# Altium schematic sheet FPGA_POWER.SchDoc
size A3
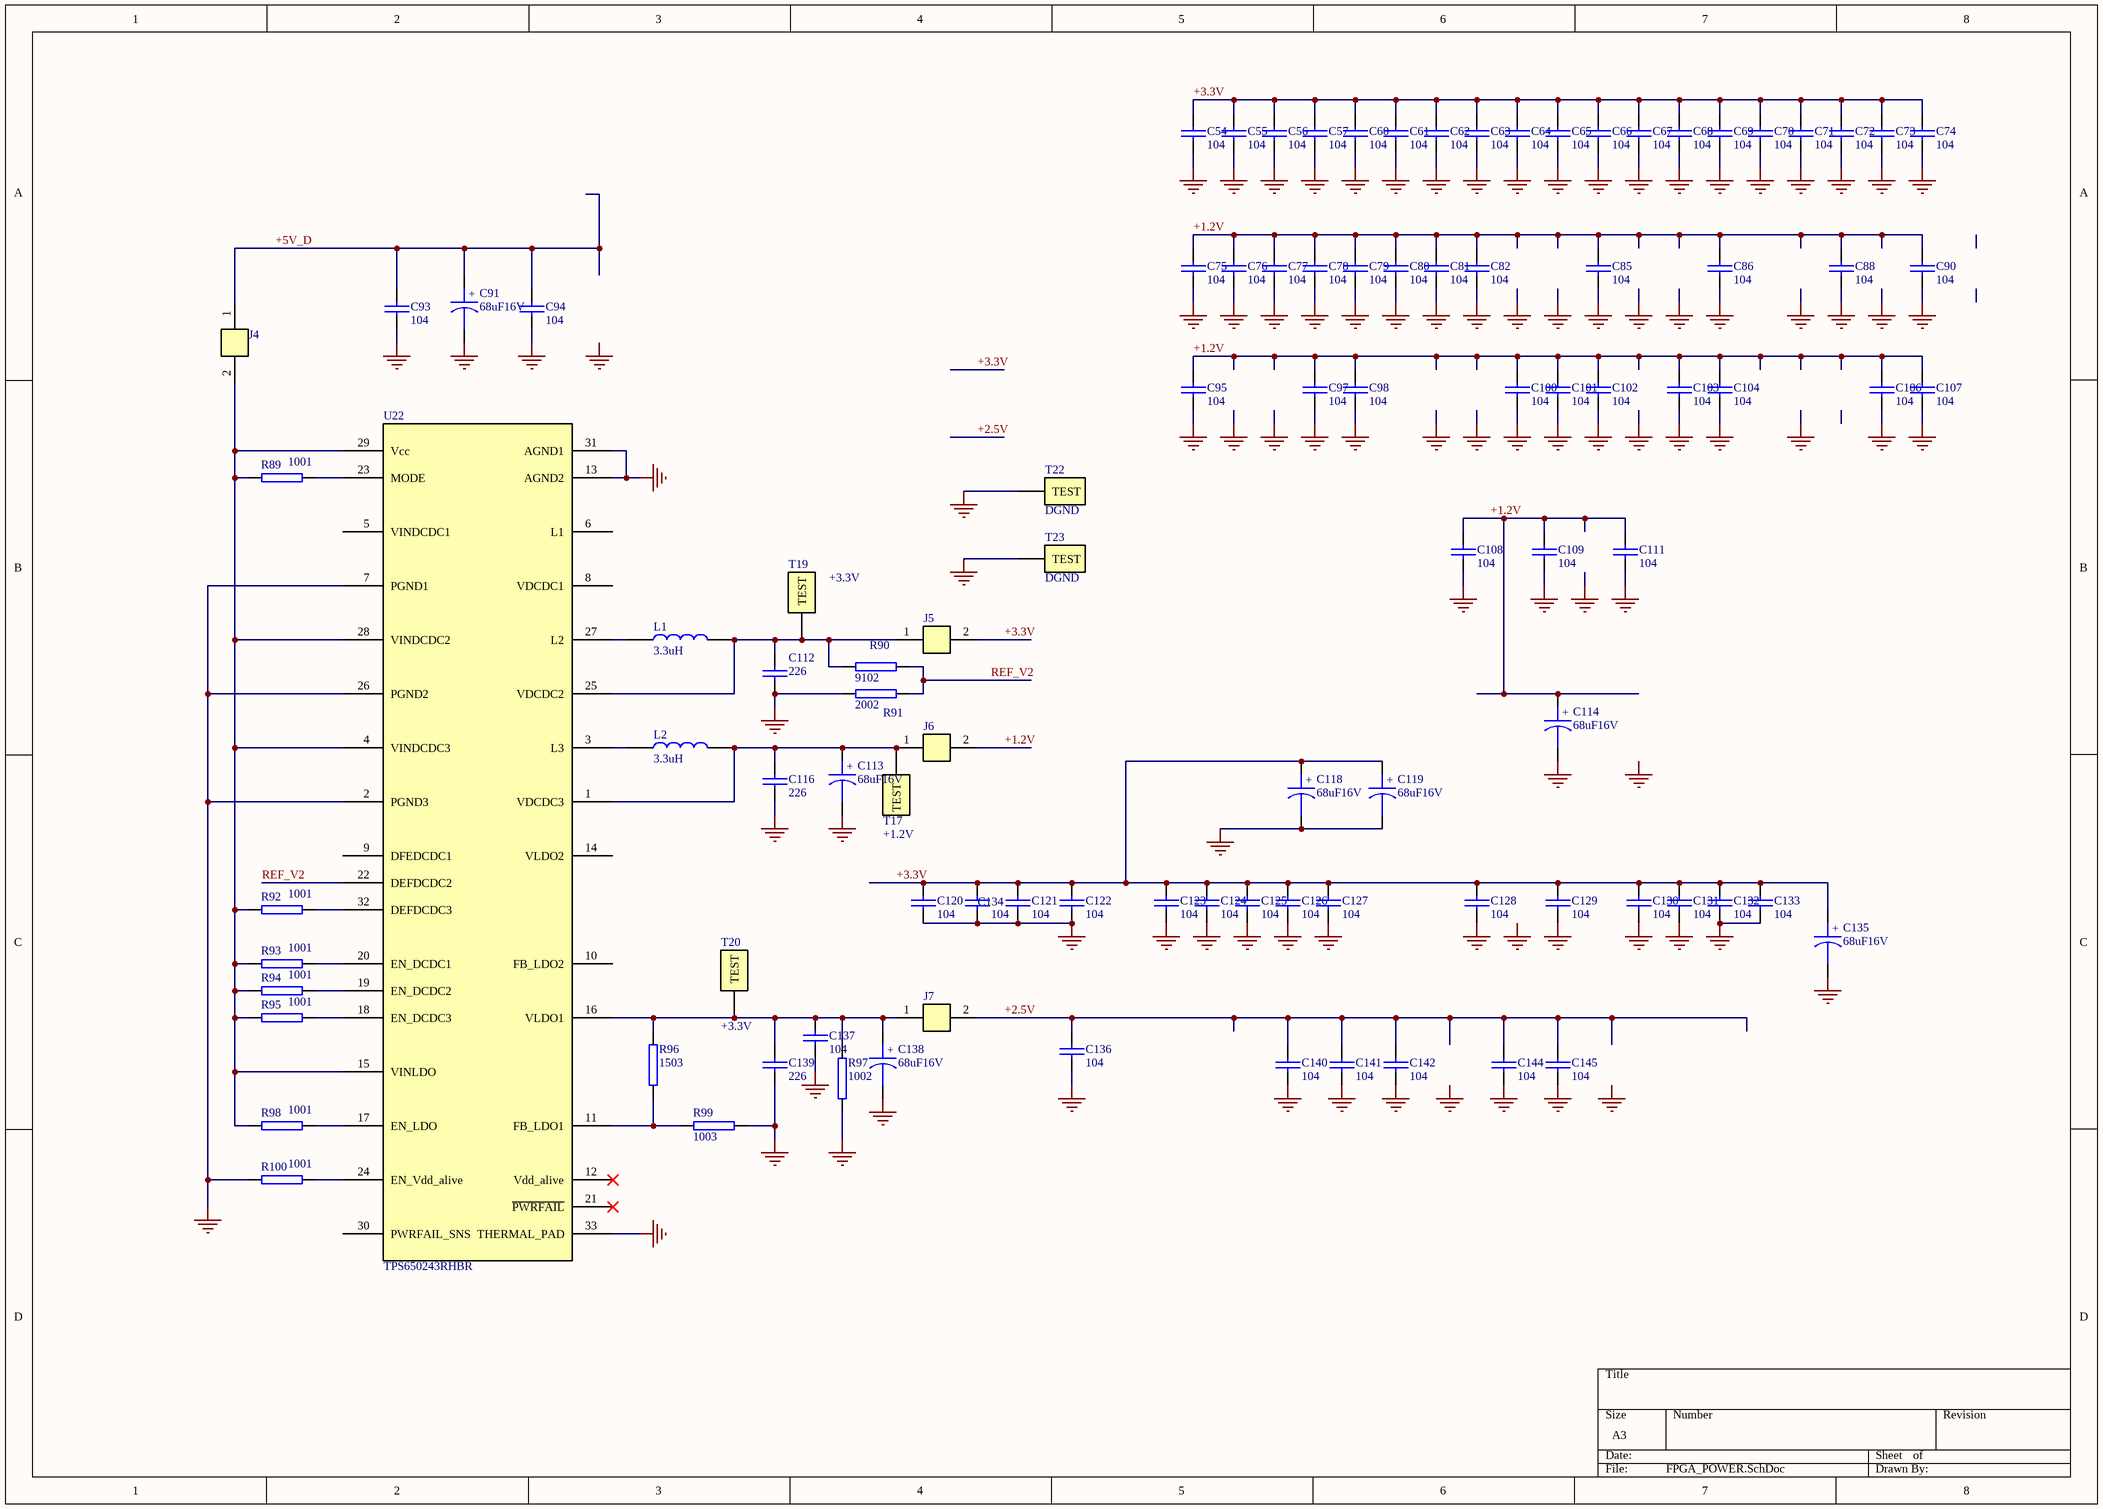
[diagram p0: FPGA_POWER.SchDoc]

## Parts
C54  104  [0805C]
C55  104  [0402C]
C56  104  [0402C]
C57  104  [0402C]
C60  104  [0402C]
C61  104  [0402C]
C62  104  [0402C]
C63  104  [0402C]
C64  104  [0402C]
C65  104  [0402C]
C66  104  [0402C]
C67  104  [0402C]
C68  104  [0402C]
C69  104  [0402C]
C70  104  [0402C]
C71  104  [0402C]
C72  104  [0402C]
C73  104  [0402C]
C74  104  [0402C]
C75  104  [0805C]
C76  104  [0402C]
C77  104  [0402C]
C78  104  [0805C]
C79  104  [0402C]
C80  104  [0402C]
C81  104  [0402C]
C82  104  [0402C]
C85  104  [0402C]
C86  104  [0402C]
C88  104  [0402C]
C90  104  [0402C]
C91  68uF16V  [6032]
C93  104  [0805C]
C94  104  [0805C]
C95  104  [0402C]
C97  104  [0402C]
C98  104  [0402C]
C100  104  [0402C]
C101  104  [0402C]
C102  104  [0402C]
C103  104  [0402C]
C104  104  [0402C]
C106  104  [0402C]
C107  104  [0402C]
C108  104  [0402C]
C109  104  [0402C]
C111  104  [0402C]
C112  226  [C226]
C113  68uF16V  [6032]
C114  68uF16V  [6032]
C116  226  [C226]
C118  68uF16V  [6032]
C119  68uF16V  [6032]
C120  104  [0402C]
C121  104  [0402C]
C122  104  [0805C]
C123  104  [0805C]
C124  104  [0805C]
C125  104  [0805C]
C126  104  [0805C]
C127  104  [0402C]
C128  104  [0805C]
C129  104  [0402C]
C130  104  [0402C]
C131  104  [0402C]
C132  104  [0402C]
C133  104  [0402C]
C134  104  [0402C]
C135  68uF16V  [6032]
C136  104  [0805C]
C137  104  [0805C]
C138  68uF16V  [6032]
C139  226  [C226]
C140  104  [0402C]
C141  104  [0402C]
C142  104  [0402C]
C144  104  [0805C]
C145  104  [0402C]
J4  (no value)  [I_ON1]
J5  (no value)  [I_ON1]
J6  (no value)  [I_ON1]
J7  (no value)  [I_ON1]
L1  3.3uH  [L3R3]
L2  3.3uH  [L3R3]
R89  1001  [0603]
R90  9102  [0603]
R91  2002  [0603]
R92  1001  [0603]
R93  1001  [0603]
R94  1001  [0603]
R95  1001  [0603]
R96  1503  [0603]
R97  1002  [0603]
R98  1001  [0603]
R99  1003  [0603]
R100  1001  [0603]
T17  +1.2V  [TEST]
T19  +3.3V  [TEST]
T20  +3.3V  [TEST]
T22  DGND  [TEST]
T23  DGND  [TEST]
U22  TPS650243RHBR  [VQFN32]

## Nets
DGND: C54.1 C55.1 C56.1 C57.1 C60.1 C61.1 C62.1 C63.1 C64.1 C65.1 C66.1 C67.1 C68.1 C69.1 C70.1 C71.1 C72.1 C73.1 C74.1 C75.1 C76.1 C77.1 C78.1 C79.1 C80.1 C81.1 C82.1 C85.1 C86.1 C88.1 C90.1 C91.2 C93.1 C94.1 C95.1 C97.1 C98.1 C100.1 C101.1 C102.1 C103.1 C104.1 C106.1 C107.1 C108.1 C109.1 C111.1 C112.2 C113.2 C114.2 C116.2 C118.2 C119.2 C120.1 C121.1 C122.1 C123.1 C124.1 C125.1 C126.1 C127.1 C128.1 C129.1 C130.1 C131.1 C132.1 C133.1 C134.1 C135.2 C136.1 C137.1 C138.2 C139.2 C140.1 C141.1 C142.1 C144.1 C145.1 R91.2 R97.2 R99.2 R100.1 T22.1(TEST) T23.1(TEST) U22.2(PGND3) U22.7(PGND1) U22.13(AGND2) U22.26(PGND2) U22.31(AGND1) U22.33(THERMAL_PAD)
+1.2V: C75.2 C76.2 C77.2 C78.2 C79.2 C80.2 C81.2 C82.2 C85.2 C86.2 C88.2 C90.2 C95.2 C97.2 C98.2 C100.2 C101.2 C102.2 C103.2 C104.2 C106.2 C107.2 C108.2 C109.2 C111.2 C114.1 J6.2
+2.5V: C136.2 C140.2 C141.2 C142.2 C144.2 C145.2 J7.2
+3.3V: C54.2 C55.2 C56.2 C57.2 C60.2 C61.2 C62.2 C63.2 C64.2 C65.2 C66.2 C67.2 C68.2 C69.2 C70.2 C71.2 C72.2 C73.2 C74.2 C118.1 C119.1 C120.2 C121.2 C122.2 C123.2 C124.2 C125.2 C126.2 C127.2 C128.2 C129.2 C130.2 C131.2 C132.2 C133.2 C134.2 C135.1 J5.2
+5V_D: C91.1 C93.2 C94.2 J4.1
REF_V2: R90.2 R91.1 U22.22(DEFDCDC2)
NetC112_1: C112.1 J5.1 L1.2 R90.1 T19.1(TEST) U22.25(VDCDC2)
NetC113_1: C113.1 C116.1 J6.1 L2.2 T17.1(TEST) U22.1(VDCDC3)
NetC137_2: C137.2 C138.1 C139.1 J7.1 R96.2 R97.1 T20.1(TEST) U22.16(VLDO1)
NetJ4_2: J4.2 R89.1 R92.1 R93.1 R94.1 R95.1 R98.1 U22.4(VINDCDC3) U22.15(VINLDO) U22.28(VINDCDC2) U22.29(Vcc)
NetL1_1: L1.1 U22.27(L2)
NetL2_1: L2.1 U22.3(L3)
NetR89_2: R89.2 U22.23(MODE)
NetR92_2: R92.2 U22.32(DEFDCDC3)
NetR93_2: R93.2 U22.20(EN_DCDC1)
NetR94_2: R94.2 U22.19(EN_DCDC2)
NetR95_2: R95.2 U22.18(EN_DCDC3)
NetR96_1: R96.1 R99.1 U22.11(FB_LDO1)
NetR98_2: R98.2 U22.17(EN_LDO)
NetR100_2: R100.2 U22.24(EN_Vdd_alive)

Not connected (* = marked no-connect by the designer): U22 5(VINDCDC1) 6(L1) 8(VDCDC1) 9(DFEDCDC1) 10(FB_LDO2) 12(Vdd_alive)* 14(VLDO2) 21(~{PWRFAIL})* 30(PWRFAIL_SNS)

## Notes on the sheet
- Labels drawn without touching a wire or pin: DGND
- (in symbol CAPACITOR POL) +

## Library data of the parts
C54-C57 C60-C82 C85 C86 C88 C90 C93-C95 C97 C98 C100-C104 C106-C109 C111 C112 C116 C120-C134 C136 C137 C139-C142 C144 C145 = CAP: Capacitor
C91 C113 C114 C118 C119 C135 C138 = CAPACITOR POL: Capacitor
J4-J7 = I_ON
L1 L2 = L
R89-R100 = RES2
T17 T19 T20 T22 T23 = TEST
U22 = TPS650243